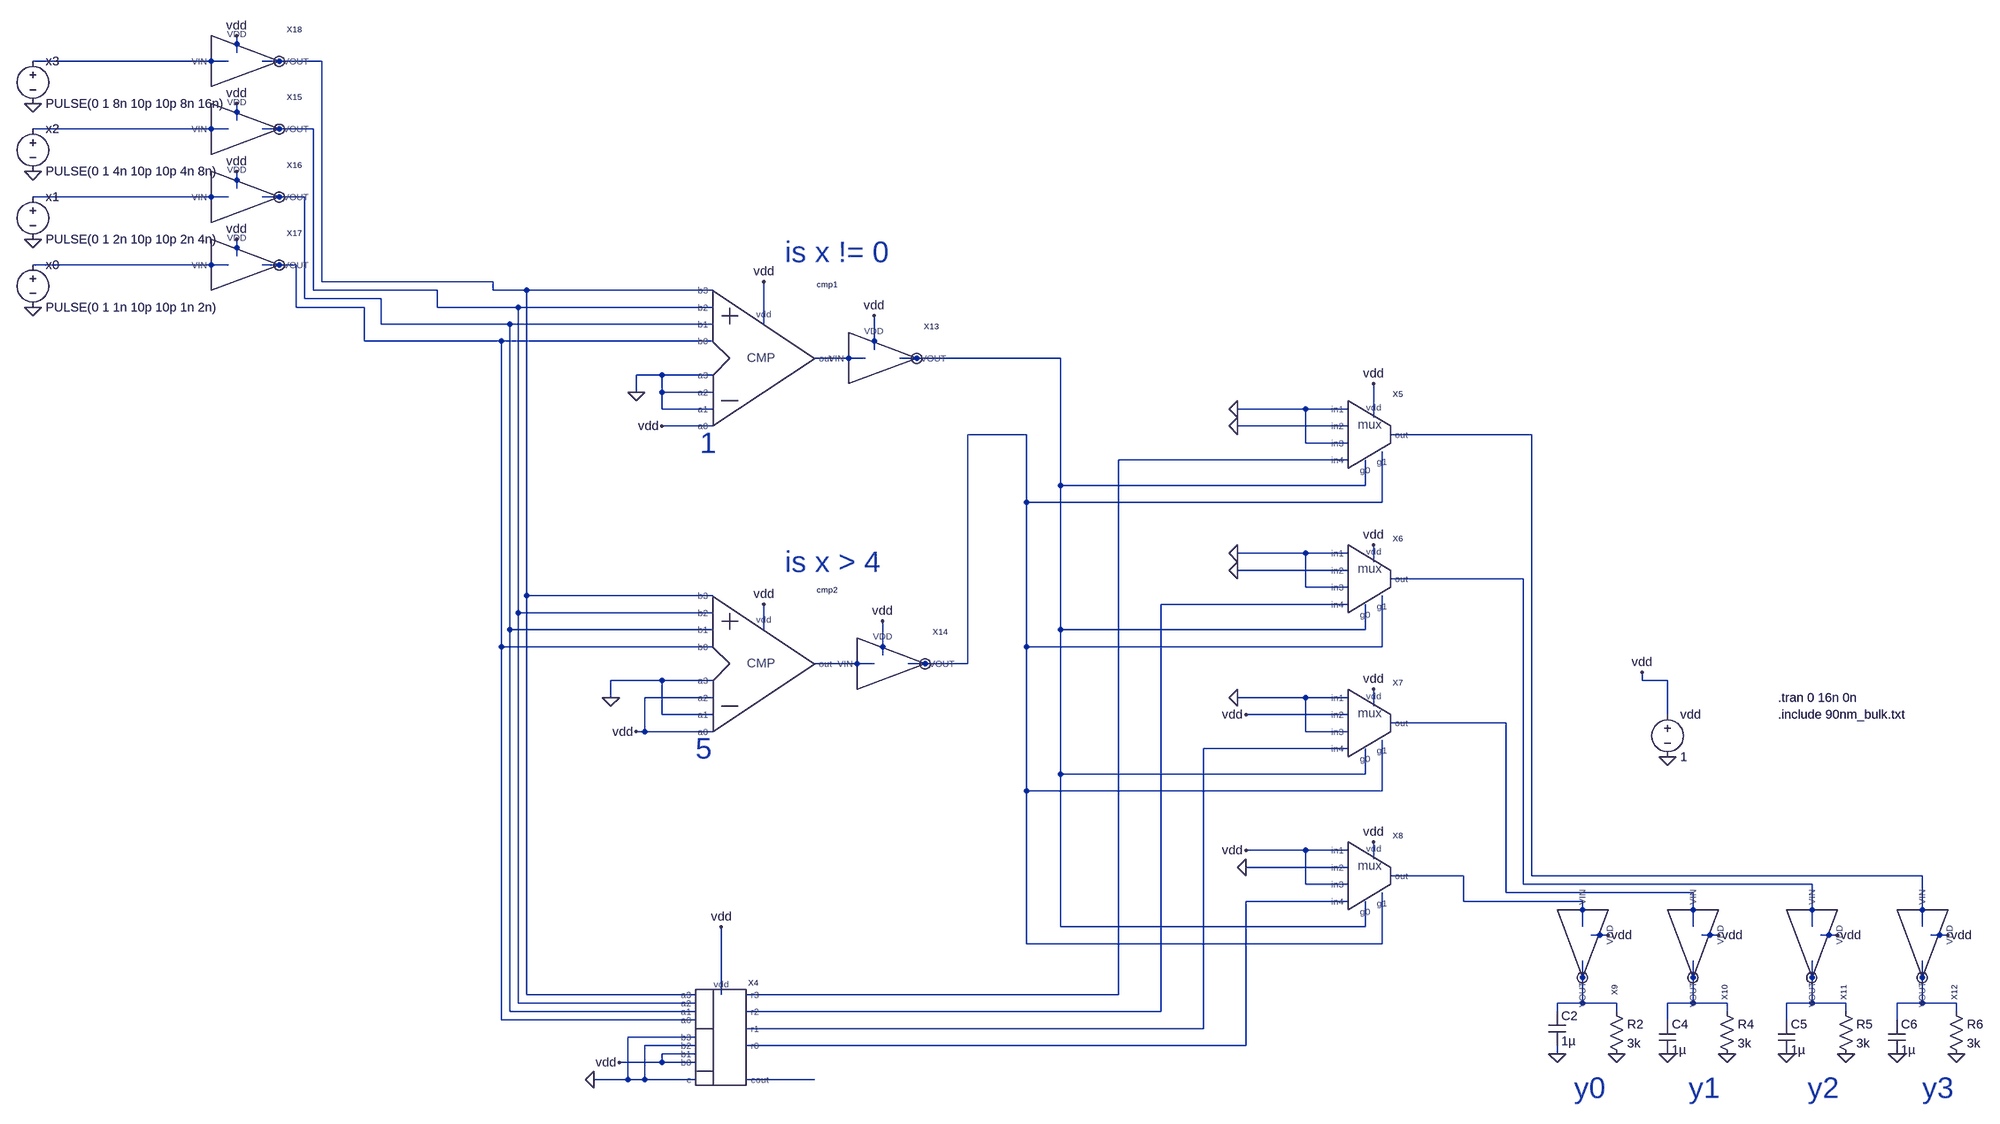
[diagram p0: schematic Formula2-inplace-test.asc]
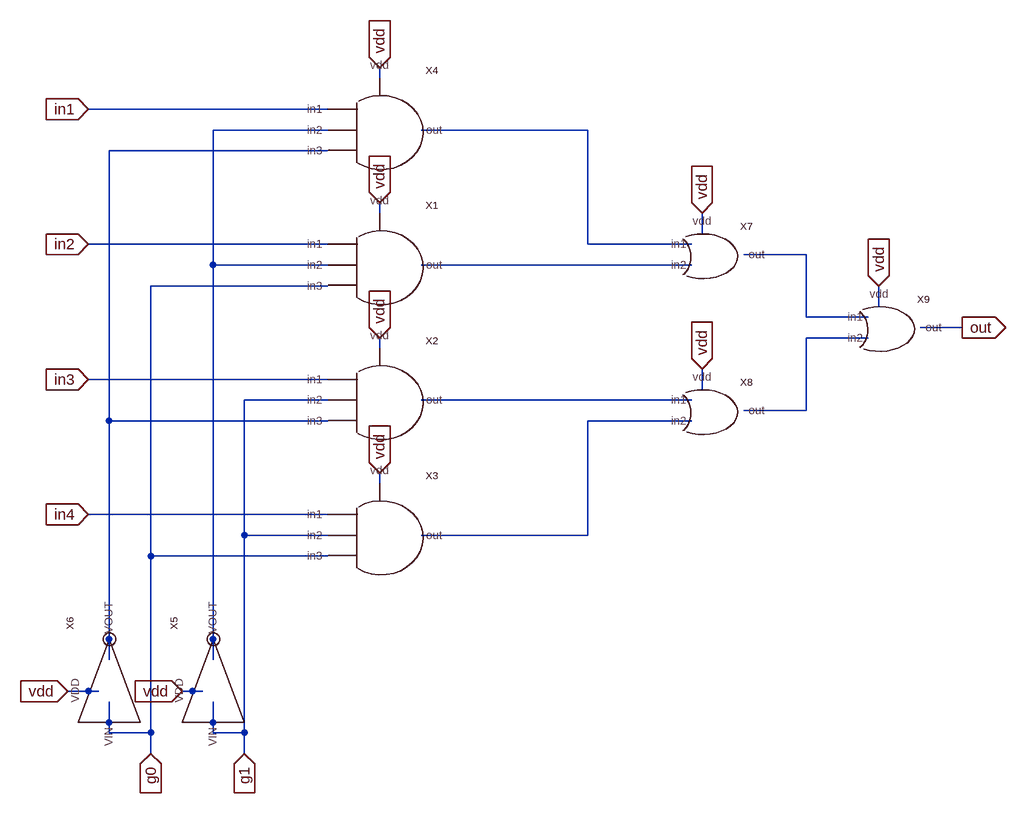
[diagram p1: sub-circuit mux4.asc]
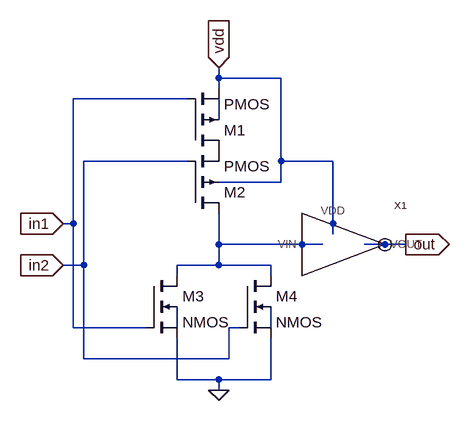
[diagram p2: sub-circuit or.asc]
Formula2-inplace-test.asc, the LTspice schematic file:
Version 4
SHEET 1 4228 1348
WIRE -4544 -1856 -4544 -1888
WIRE -4560 -1840 -4928 -1840
WIRE -4384 -1840 -4496 -1840
WIRE -4544 -1728 -4544 -1760
WIRE -4560 -1712 -4928 -1712
WIRE -4400 -1712 -4496 -1712
WIRE -4544 -1600 -4544 -1632
WIRE -4560 -1584 -4928 -1584
WIRE -4416 -1584 -4496 -1584
WIRE -4544 -1472 -4544 -1504
WIRE -4560 -1456 -4928 -1456
WIRE -4432 -1456 -4496 -1456
WIRE -4384 -1424 -4384 -1840
WIRE -3920 -1424 -4384 -1424
WIRE -4400 -1408 -4400 -1712
WIRE -4160 -1408 -4400 -1408
WIRE -3920 -1408 -3920 -1424
WIRE -3856 -1408 -3920 -1408
WIRE -3344 -1408 -3856 -1408
WIRE -4416 -1392 -4416 -1584
WIRE -4272 -1392 -4416 -1392
WIRE -4432 -1376 -4432 -1456
WIRE -4304 -1376 -4432 -1376
WIRE -4160 -1376 -4160 -1408
WIRE -3872 -1376 -4160 -1376
WIRE -3344 -1376 -3872 -1376
WIRE -4272 -1344 -4272 -1392
WIRE -3888 -1344 -4272 -1344
WIRE -3344 -1344 -3888 -1344
WIRE -3248 -1344 -3248 -1424
WIRE -4304 -1312 -4304 -1376
WIRE -3904 -1312 -4304 -1312
WIRE -3344 -1312 -3904 -1312
WIRE -3040 -1296 -3040 -1360
WIRE -3056 -1280 -3152 -1280
WIRE -2224 -1280 -2992 -1280
WIRE -3440 -1248 -3488 -1248
WIRE -3344 -1248 -3440 -1248
WIRE -3488 -1216 -3488 -1248
WIRE -3440 -1216 -3440 -1248
WIRE -3344 -1216 -3440 -1216
WIRE -3440 -1184 -3440 -1216
WIRE -3344 -1184 -3440 -1184
WIRE -1312 -1184 -1632 -1184
WIRE -1232 -1184 -1312 -1184
WIRE -1184 -1168 -1184 -1232
WIRE -3344 -1152 -3440 -1152
WIRE -1232 -1152 -1632 -1152
WIRE -2288 -1136 -2864 -1136
WIRE -768 -1136 -1152 -1136
WIRE -1312 -1120 -1312 -1184
WIRE -1232 -1120 -1312 -1120
WIRE -1232 -1088 -1856 -1088
WIRE -2224 -1040 -2224 -1280
WIRE -1200 -1040 -1200 -1088
WIRE -1200 -1040 -2224 -1040
WIRE -2288 -1008 -2288 -1136
WIRE -1168 -1008 -1168 -1104
WIRE -1168 -1008 -2288 -1008
WIRE -1312 -912 -1632 -912
WIRE -1232 -912 -1312 -912
WIRE -1184 -896 -1184 -928
WIRE -1232 -880 -1632 -880
WIRE -784 -864 -1152 -864
WIRE -1312 -848 -1312 -912
WIRE -1232 -848 -1312 -848
WIRE -3856 -832 -3856 -1408
WIRE -3344 -832 -3856 -832
WIRE -1232 -816 -1776 -816
WIRE -3872 -800 -3872 -1376
WIRE -3344 -800 -3872 -800
WIRE -3888 -768 -3888 -1344
WIRE -3344 -768 -3888 -768
WIRE -3248 -768 -3248 -816
WIRE -2224 -768 -2224 -1040
WIRE -1200 -768 -1200 -816
WIRE -1200 -768 -2224 -768
WIRE -3904 -736 -3904 -1312
WIRE -3344 -736 -3904 -736
WIRE -2288 -736 -2288 -1008
WIRE -1168 -736 -1168 -832
WIRE -1168 -736 -2288 -736
WIRE -3024 -720 -3024 -784
WIRE -3040 -704 -3152 -704
WIRE -2864 -704 -2864 -1136
WIRE -2864 -704 -2976 -704
WIRE -3440 -672 -3536 -672
WIRE -3344 -672 -3440 -672
WIRE -560 -672 -560 -688
WIRE -512 -672 -560 -672
WIRE -3536 -640 -3536 -672
WIRE -3344 -640 -3472 -640
WIRE -1312 -640 -1632 -640
WIRE -1232 -640 -1312 -640
WIRE -1184 -624 -1184 -656
WIRE -3440 -608 -3440 -672
WIRE -3344 -608 -3440 -608
WIRE -1232 -608 -1616 -608
WIRE -512 -608 -512 -672
WIRE -816 -592 -1152 -592
WIRE -3472 -576 -3472 -640
WIRE -3472 -576 -3488 -576
WIRE -3344 -576 -3472 -576
WIRE -1312 -576 -1312 -640
WIRE -1232 -576 -1312 -576
WIRE -1232 -544 -1696 -544
WIRE -2224 -496 -2224 -768
WIRE -1200 -496 -1200 -544
WIRE -1200 -496 -2224 -496
WIRE -2288 -464 -2288 -736
WIRE -1168 -464 -1168 -560
WIRE -1168 -464 -2288 -464
WIRE -1312 -352 -1616 -352
WIRE -1232 -352 -1312 -352
WIRE -1184 -336 -1184 -368
WIRE -1232 -320 -1616 -320
WIRE -896 -304 -1152 -304
WIRE -768 -304 -768 -1136
WIRE -32 -304 -768 -304
WIRE -1312 -288 -1312 -352
WIRE -1232 -288 -1312 -288
WIRE -784 -288 -784 -864
WIRE -240 -288 -784 -288
WIRE -816 -272 -816 -592
WIRE -464 -272 -816 -272
WIRE -1232 -256 -1616 -256
WIRE -896 -256 -896 -304
WIRE -672 -256 -896 -256
WIRE -2224 -208 -2224 -496
WIRE -1200 -208 -1200 -256
WIRE -1200 -208 -2224 -208
WIRE -672 -208 -672 -256
WIRE -464 -208 -464 -272
WIRE -240 -208 -240 -288
WIRE -32 -208 -32 -304
WIRE -624 -192 -656 -192
WIRE -416 -192 -448 -192
WIRE -192 -192 -224 -192
WIRE 16 -192 -16 -192
WIRE -2288 -176 -2288 -464
WIRE -1168 -176 -1168 -272
WIRE -1168 -176 -2288 -176
WIRE -3856 -80 -3856 -832
WIRE -3376 -80 -3856 -80
WIRE -3328 -80 -3328 -208
WIRE -1856 -80 -1856 -1088
WIRE -1856 -80 -3280 -80
WIRE -3872 -64 -3872 -800
WIRE -3376 -64 -3872 -64
WIRE -672 -64 -672 -144
WIRE -672 -64 -720 -64
WIRE -608 -64 -672 -64
WIRE -464 -64 -464 -144
WIRE -464 -64 -512 -64
WIRE -400 -64 -464 -64
WIRE -240 -64 -240 -144
WIRE -240 -64 -288 -64
WIRE -176 -64 -240 -64
WIRE -32 -64 -32 -144
WIRE -32 -64 -80 -64
WIRE 32 -64 -32 -64
WIRE -3888 -48 -3888 -768
WIRE -3376 -48 -3888 -48
WIRE -1776 -48 -1776 -816
WIRE -1776 -48 -3280 -48
WIRE -720 -48 -720 -64
WIRE -608 -48 -608 -64
WIRE -400 -48 -400 -64
WIRE -176 -48 -176 -64
WIRE 32 -48 32 -64
WIRE -3904 -32 -3904 -736
WIRE -3376 -32 -3904 -32
WIRE -512 -32 -512 -64
WIRE -288 -32 -288 -64
WIRE -80 -32 -80 -64
WIRE -1696 -16 -1696 -544
WIRE -1696 -16 -3280 -16
WIRE -3376 0 -3504 0
WIRE -3376 16 -3472 16
WIRE -1616 16 -1616 -256
WIRE -1616 16 -3280 16
WIRE -3376 32 -3440 32
WIRE -720 32 -720 16
WIRE -3440 48 -3440 32
WIRE -3440 48 -3520 48
WIRE -3376 48 -3440 48
WIRE -3504 80 -3504 0
WIRE -3504 80 -3568 80
WIRE -3472 80 -3472 16
WIRE -3472 80 -3504 80
WIRE -3376 80 -3472 80
WIRE -3152 80 -3280 80
FLAG -4928 -1504 0
FLAG -4928 -1376 0
FLAG -4928 -1632 0
FLAG -4928 -1760 0
FLAG -720 32 0
FLAG -608 32 0
FLAG -512 32 0
FLAG -400 32 0
FLAG -288 32 0
FLAG -176 32 0
FLAG -80 32 0
FLAG 32 32 0
FLAG -512 -528 0
FLAG -560 -688 vdd
FLAG -624 -192 vdd
FLAG -416 -192 vdd
FLAG -192 -192 vdd
FLAG 16 -192 vdd
FLAG -3488 -1216 0
FLAG -3536 -640 0
FLAG -3568 80 0
FLAG -3248 -1424 vdd
FLAG -3488 -576 vdd
FLAG -3328 -208 vdd
FLAG -3440 -1152 vdd
FLAG -3248 -816 vdd
FLAG -3520 48 vdd
FLAG -1616 -352 vdd
FLAG -1632 -640 0
FLAG -1632 -912 0
FLAG -1632 -1184 0
FLAG -1616 -608 vdd
FLAG -1616 -320 0
FLAG -1632 -1152 0
FLAG -1632 -880 0
FLAG -3024 -784 vdd
FLAG -3040 -1360 vdd
FLAG -1184 -1232 vdd
FLAG -1184 -928 vdd
FLAG -1184 -656 vdd
FLAG -1184 -368 vdd
FLAG -4544 -1504 vdd
FLAG -4544 -1888 vdd
FLAG -4544 -1760 vdd
FLAG -4544 -1632 vdd
SYMBOL voltage -4928 -1856 R0
WINDOW 123 0 0 Left 2
WINDOW 39 0 0 Left 2
SYMATTR InstName x3
SYMATTR Value PULSE(0 1 8n 10p 10p 8n 16n)
SYMBOL voltage -4928 -1728 R0
WINDOW 123 0 0 Left 2
WINDOW 39 0 0 Left 2
SYMATTR InstName x2
SYMATTR Value PULSE(0 1 4n 10p 10p 4n 8n)
SYMBOL voltage -4928 -1600 R0
WINDOW 123 0 0 Left 2
WINDOW 39 0 0 Left 2
SYMATTR InstName x1
SYMATTR Value PULSE(0 1 2n 10p 10p 2n 4n)
SYMBOL voltage -4928 -1472 R0
WINDOW 123 0 0 Left 2
WINDOW 39 0 0 Left 2
SYMATTR InstName x0
SYMATTR Value PULSE(0 1 1n 10p 10p 1n 2n)
SYMBOL voltage -512 -624 R0
WINDOW 123 0 0 Left 2
WINDOW 39 0 0 Left 2
SYMATTR InstName vdd
SYMATTR Value 1
SYMBOL res -624 -64 R0
SYMATTR InstName R2
SYMATTR Value 3k
SYMBOL cap -736 -48 R0
SYMATTR InstName C2
SYMATTR Value 1µ
SYMBOL res -416 -64 R0
SYMATTR InstName R4
SYMATTR Value 3k
SYMBOL cap -528 -32 R0
SYMATTR InstName C4
SYMATTR Value 1µ
SYMBOL res -192 -64 R0
SYMATTR InstName R5
SYMATTR Value 3k
SYMBOL cap -304 -32 R0
SYMATTR InstName C5
SYMATTR Value 1µ
SYMBOL res 16 -64 R0
SYMATTR InstName R6
SYMATTR Value 3k
SYMBOL cap -96 -32 R0
SYMATTR InstName C6
SYMATTR Value 1µ
SYMBOL inverter -672 -192 R90
SYMATTR InstName X9
SYMBOL inverter -464 -192 R90
SYMATTR InstName X10
SYMBOL inverter -240 -192 R90
SYMATTR InstName X11
SYMBOL inverter -32 -192 R90
SYMATTR InstName X12
SYMBOL comparator -3280 -1280 R0
SYMATTR InstName cmp1
SYMBOL comparator -3280 -704 R0
SYMATTR InstName cmp2
SYMBOL 4bitAdder -3328 -16 R0
SYMATTR InstName X4
SYMBOL mux4 -1184 -1136 R0
SYMATTR InstName X5
SYMBOL mux4 -1184 -864 R0
SYMATTR InstName X6
SYMBOL mux4 -1184 -592 R0
SYMATTR InstName X7
SYMBOL mux4 -1184 -304 R0
SYMATTR InstName X8
SYMBOL inverter -3040 -1280 R0
SYMATTR InstName X13
SYMBOL inverter -3024 -704 R0
SYMATTR InstName X14
SYMBOL inverter -4544 -1712 R0
SYMATTR InstName X15
SYMBOL inverter -4544 -1584 R0
SYMATTR InstName X16
SYMBOL inverter -4544 -1456 R0
SYMATTR InstName X17
SYMBOL inverter -4544 -1840 R0
SYMATTR InstName X18
TEXT -304 -608 Left 2 !.include 90nm_bulk.txt
TEXT -304 -640 Left 2 !.tran 0 16n 0n
TEXT -688 96 Left 5 ;y0
TEXT -472 96 Left 5 ;y1
TEXT -248 96 Left 5 ;y2
TEXT -32 96 Left 5 ;y3
TEXT -3368 -1120 Left 5 ;1
TEXT -3376 -544 Left 5 ;5
TEXT -3208 -1480 Left 5 ;is x != 0
TEXT -3208 -896 Left 5 ;is x > 4

mux4.asc, the sub-circuit schematic file:
Version 4
SHEET 1 1428 876
WIRE 432 -256 432 -272
WIRE 352 -208 -16 -208
WIRE 352 -176 176 -176
WIRE 752 -176 496 -176
WIRE 352 -144 16 -144
WIRE 432 -48 432 -64
WIRE 928 -16 928 -48
WIRE 352 0 -16 0
WIRE 752 0 752 -176
WIRE 912 0 752 0
WIRE 1088 16 992 16
WIRE 176 32 176 -176
WIRE 352 32 176 32
WIRE 912 32 496 32
WIRE 352 64 80 64
WIRE 1200 96 1200 64
WIRE 1088 112 1088 16
WIRE 1184 112 1088 112
WIRE 1328 128 1264 128
WIRE 1184 144 1088 144
WIRE 432 160 432 144
WIRE 352 208 -16 208
WIRE 928 224 928 192
WIRE 352 240 224 240
WIRE 912 240 496 240
WIRE 1088 256 1088 144
WIRE 1088 256 992 256
WIRE 16 272 16 -144
WIRE 352 272 16 272
WIRE 912 272 752 272
WIRE 432 368 432 352
WIRE 352 416 -16 416
WIRE 224 448 224 240
WIRE 352 448 224 448
WIRE 752 448 752 272
WIRE 752 448 496 448
WIRE 80 480 80 64
WIRE 352 480 80 480
WIRE 16 640 16 272
WIRE 176 640 176 32
WIRE 0 688 -48 688
WIRE 160 688 128 688
WIRE 16 752 16 704
WIRE 80 752 80 480
WIRE 80 752 16 752
WIRE 176 752 176 704
WIRE 224 752 224 448
WIRE 224 752 176 752
WIRE 80 784 80 752
WIRE 224 784 224 752
FLAG -16 -208 in1
IOPIN -16 -208 In
FLAG -16 0 in2
IOPIN -16 0 In
FLAG -16 208 in3
IOPIN -16 208 In
FLAG -16 416 in4
IOPIN -16 416 In
FLAG 80 784 g0
IOPIN 80 784 In
FLAG 224 784 g1
IOPIN 224 784 In
FLAG -48 688 vdd
IOPIN -48 688 In
FLAG 128 688 vdd
IOPIN 128 688 In
FLAG 432 352 vdd
IOPIN 432 352 In
FLAG 432 144 vdd
IOPIN 432 144 In
FLAG 432 -64 vdd
IOPIN 432 -64 In
FLAG 432 -272 vdd
IOPIN 432 -272 In
FLAG 928 192 vdd
IOPIN 928 192 In
FLAG 928 -48 vdd
IOPIN 928 -48 In
FLAG 1200 64 vdd
IOPIN 1200 64 In
FLAG 1328 128 out
IOPIN 1328 128 Out
SYMBOL and3 432 32 R0
SYMATTR InstName X1
SYMBOL and3 432 240 R0
SYMATTR InstName X2
SYMBOL and3 432 -176 R0
SYMATTR InstName X4
SYMBOL inverter 176 688 R270
SYMATTR InstName X5
SYMBOL inverter 16 688 R270
SYMATTR InstName X6
SYMBOL and3 432 448 R0
SYMATTR InstName X3
SYMBOL or 928 16 R0
SYMATTR InstName X7
SYMBOL or 928 256 R0
SYMATTR InstName X8
SYMBOL or 1200 128 R0
SYMATTR InstName X9

or.asc, the sub-circuit schematic file:
Version 4
SHEET 1 880 680
WIRE 288 -128 288 -144
WIRE 384 -128 288 -128
WIRE 288 -112 288 -128
WIRE 240 -96 64 -96
WIRE 288 -64 288 -96
WIRE 240 0 80 0
WIRE 384 0 384 -128
WIRE 464 0 384 0
WIRE 384 32 384 0
WIRE 384 32 288 32
WIRE 64 96 64 -96
WIRE 64 96 48 96
WIRE 464 112 464 0
WIRE 288 128 288 80
WIRE 448 128 288 128
WIRE 576 128 512 128
WIRE 80 160 80 0
WIRE 80 160 48 160
WIRE 288 160 288 128
WIRE 288 160 224 160
WIRE 368 160 288 160
WIRE 224 176 224 160
WIRE 368 176 368 160
WIRE 64 256 64 96
WIRE 176 256 64 256
WIRE 224 256 224 224
WIRE 320 256 304 256
WIRE 368 256 368 224
WIRE 80 304 80 160
WIRE 304 304 304 256
WIRE 304 304 80 304
WIRE 224 336 224 272
WIRE 288 336 224 336
WIRE 368 336 368 272
WIRE 368 336 288 336
WIRE 288 352 288 336
FLAG 48 96 in1
IOPIN 48 96 In
FLAG 48 160 in2
IOPIN 48 160 In
FLAG 576 128 out
IOPIN 576 128 Out
FLAG 288 -144 vdd
IOPIN 288 -144 In
FLAG 288 352 0
SYMBOL pmos4 240 -16 M180
SYMATTR InstName M1
SYMATTR Value2 l=90n w=400n
SYMBOL pmos4 240 80 M180
SYMATTR InstName M2
SYMATTR Value2 l=90n w=400n
SYMBOL nmos4 176 176 R0
SYMATTR InstName M3
SYMATTR Value2 l=90n w=200n
SYMBOL nmos4 320 176 R0
SYMATTR InstName M4
SYMATTR Value2 l=90n w=200n
SYMBOL inverter 464 128 R0
SYMATTR InstName X1

The netlist it stands for:
* Formula2-inplace-test.asc
V§x3 N001 0 PULSE(0 1 8n 10p 10p 8n 16n)
V§x2 N003 0 PULSE(0 1 4n 10p 10p 4n 8n)
V§x1 N005 0 PULSE(0 1 2n 10p 10p 2n 4n)
V§x0 N007 0 PULSE(0 1 1n 10p 10p 1n 2n)
vdd vdd 0 1
R2 N021 0 3k
C2 N021 0 1µ
R4 N022 0 3k
C4 N022 0 1µ
R5 N023 0 3k
C5 N023 0 1µ
R6 N024 0 3k
C6 N024 0 1µ
XX9 vdd N021 N019 inverter  ; pins VDD VOUT VIN
XX10 vdd N022 N017 inverter  ; pins VDD VOUT VIN
XX11 vdd N023 N014 inverter  ; pins VDD VOUT VIN
XX12 vdd N024 N012 inverter  ; pins VDD VOUT VIN
Xcmp1 N008 N006 N004 N002 vdd 0 0 0 vdd N009 comparator  ; pins b0 b1 b2 b3 a0 a1 a2 a3 vdd out
Xcmp2 N008 N006 N004 N002 vdd 0 vdd 0 vdd N016 comparator  ; pins b0 b1 b2 b3 a0 a1 a2 a3 vdd out
XX4 N008 N006 N004 N002 vdd vdd 0 0 0 N020 N018 N015 N013 N025 vdd 4bitAdder  ; pins a0 a1 a2 a3 b0 b1 b2 b3 c r0 r1 r2 r3 cout vdd
XX5 0 0 0 N013 N012 N010 N011 vdd mux4
XX6 0 0 0 N015 N014 N010 N011 vdd mux4
XX7 0 vdd 0 N018 N017 N010 N011 vdd mux4
XX8 vdd 0 vdd N020 N019 N010 N011 vdd mux4
XX13 vdd N010 N009 inverter  ; pins VDD VOUT VIN
XX14 vdd N011 N016 inverter  ; pins VDD VOUT VIN
XX15 vdd N004 N003 inverter  ; pins VDD VOUT VIN
XX16 vdd N006 N005 inverter  ; pins VDD VOUT VIN
XX17 vdd N008 N007 inverter  ; pins VDD VOUT VIN
XX18 vdd N002 N001 inverter  ; pins VDD VOUT VIN

* block symbol definitions
.subckt mux4 in1 in2 in3 in4 out g0 g1 vdd
XX1 in2 N001 g0 N005 vdd and3  ; pins in1 in2 in3 out vdd
XX2 in3 g1 N003 N007 vdd and3  ; pins in1 in2 in3 out vdd
XX4 in1 N001 N003 N002 vdd and3  ; pins in1 in2 in3 out vdd
XX5 vdd N001 g1 inverter  ; pins VDD VOUT VIN
XX6 vdd N003 g0 inverter  ; pins VDD VOUT VIN
XX3 in4 g1 g0 N008 vdd and3  ; pins in1 in2 in3 out vdd
XX7 N002 N005 vdd N004 or
XX8 N007 N008 vdd N006 or
XX9 N004 N006 vdd out or
.ends mux4

.subckt or in1 in2 vdd out
M1 P001 in1 vdd N001 PMOS l=90n w=400n
M2 N002 in2 P001 vdd PMOS l=90n w=400n
M3 N002 in1 0 N003 NMOS l=90n w=200n
M4 N002 in2 0 N004 NMOS l=90n w=200n
XX1 vdd out N002 inverter  ; pins VDD VOUT VIN
.ends or

.model NMOS NMOS
.model PMOS PMOS
.lib standard.mos
.include 90nm_bulk.txt
.tran 0 16n 0n
* y0
* y1
* y2
* y3
* 1
* 5
* is x != 0
* is x > 4
.backanno
.end